# Altium schematic sheet GEM_AVD_eFuse.SchDoc: GEM AVD eFuse
size 594 x 420 mm; Author: G.Kasprowicz; CompanyName: WUT ISE; DrawnBy: G.Kasprowicz; Organization: WUT ISE; Address1: PW ISE; Address2: Nowowiejska 15/19 00-665 Warsaw; Address3: gkasprow@gmail.com; Revision: 2; SheetNumber: 1; SheetTotal: 6; ModifiedBy: -; CheckedDate: -; Title2: Top; DivGrp: WUT ISE; Designer: G.Kasprowicz; ModifiedDate: -; ProjectName: Sensor Box
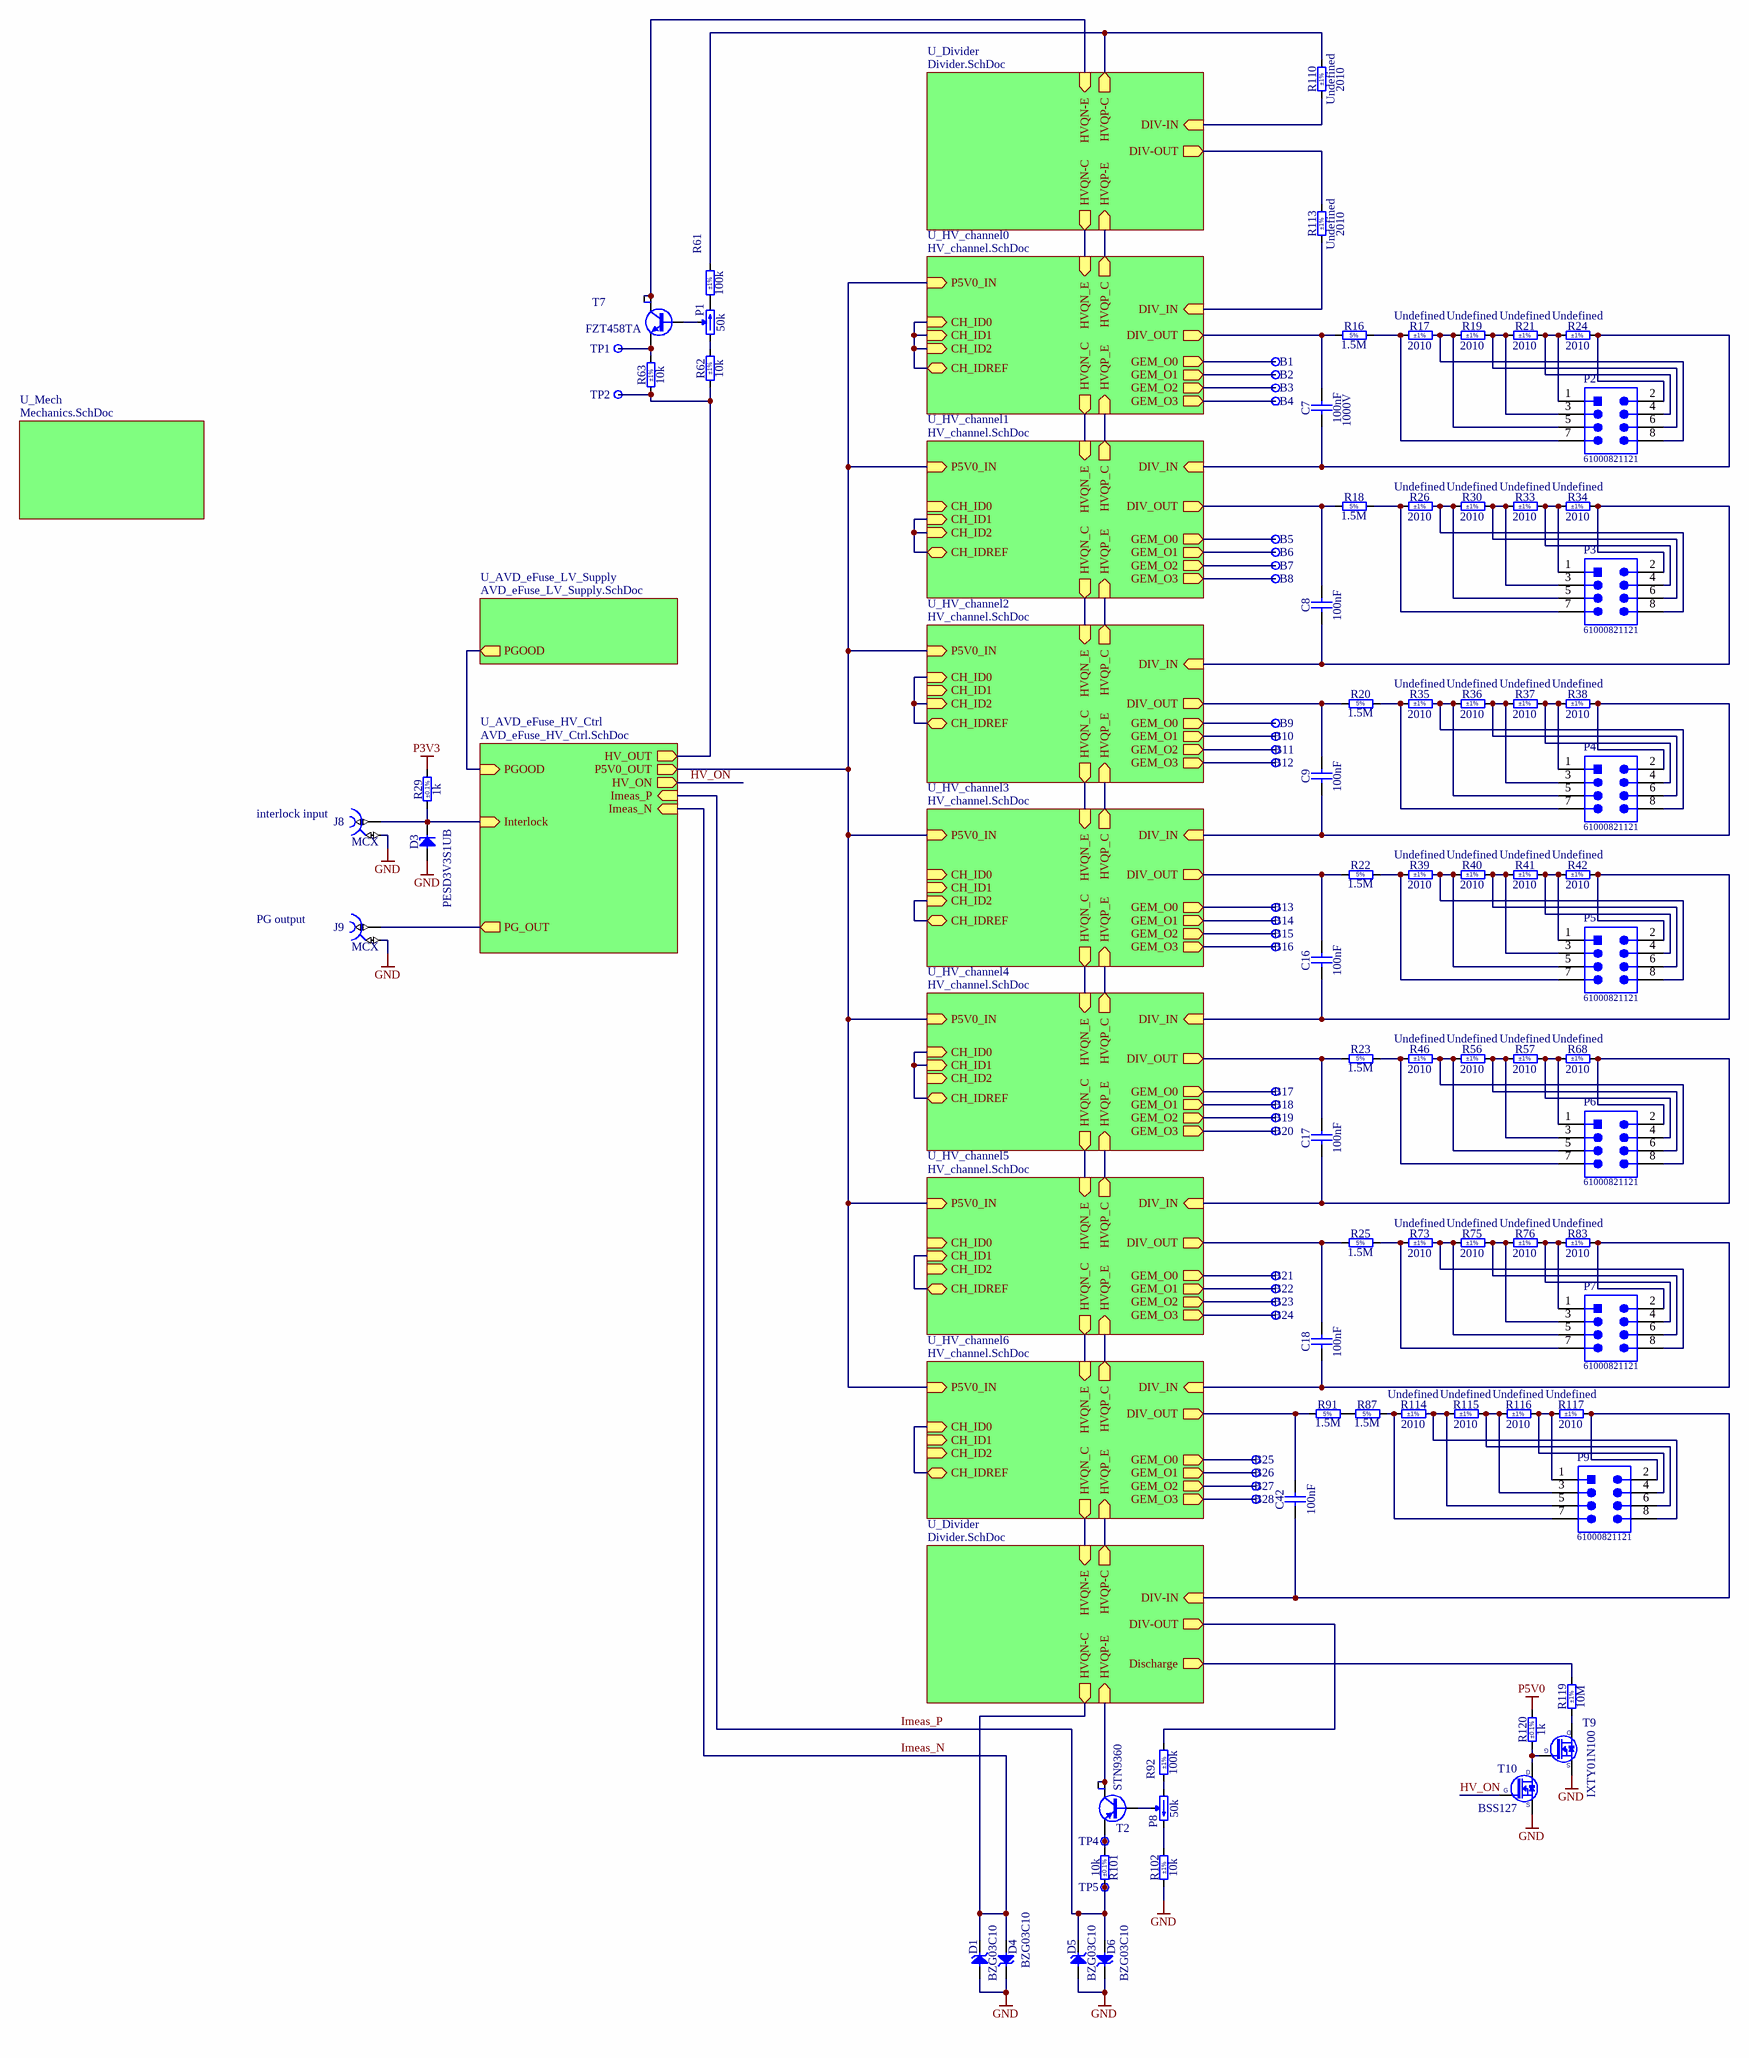
[diagram p0: GEM_AVD_eFuse.SchDoc]

## Parts
B1  Socket  [MULTI-CONTACT_23.1000]  (value not drawn)
B2  Socket  [MULTI-CONTACT_23.1000]  (value not drawn)
B3  Socket  [MULTI-CONTACT_23.1000]  (value not drawn)
B4  Socket  [MULTI-CONTACT_23.1000]  (value not drawn)
B5  Socket  [MULTI-CONTACT_23.1000]  (value not drawn)
B6  Socket  [MULTI-CONTACT_23.1000]  (value not drawn)
B7  Socket  [MULTI-CONTACT_23.1000]  (value not drawn)
B8  Socket  [MULTI-CONTACT_23.1000]  (value not drawn)
B9  Socket  [MULTI-CONTACT_23.1000]  (value not drawn)
B10  Socket  [MULTI-CONTACT_23.1000]  (value not drawn)
B11  Socket  [MULTI-CONTACT_23.1000]  (value not drawn)
B12  Socket  [MULTI-CONTACT_23.1000]  (value not drawn)
B13  Socket  [MULTI-CONTACT_23.1000]  (value not drawn)
B14  Socket  [MULTI-CONTACT_23.1000]  (value not drawn)
B15  Socket  [MULTI-CONTACT_23.1000]  (value not drawn)
B16  Socket  [MULTI-CONTACT_23.1000]  (value not drawn)
B17  Socket  [MULTI-CONTACT_23.1000]  (value not drawn)
B18  Socket  [MULTI-CONTACT_23.1000]  (value not drawn)
B19  Socket  [MULTI-CONTACT_23.1000]  (value not drawn)
B20  Socket  [MULTI-CONTACT_23.1000]  (value not drawn)
B21  Socket  [MULTI-CONTACT_23.1000]  (value not drawn)
B22  Socket  [MULTI-CONTACT_23.1000]  (value not drawn)
B23  Socket  [MULTI-CONTACT_23.1000]  (value not drawn)
B24  Socket  [MULTI-CONTACT_23.1000]  (value not drawn)
B25  Socket  [MULTI-CONTACT_23.1000]  (value not drawn)
B26  Socket  [MULTI-CONTACT_23.1000]  (value not drawn)
B27  Socket  [MULTI-CONTACT_23.1000]  (value not drawn)
B28  Socket  [MULTI-CONTACT_23.1000]  (value not drawn)
C7  100nF  Voltage: 1000V  [CAPC4532X185N]
C8  100nF  [CAPC4532X185N]
C9  100nF  [CAPC4532X185N]
C16  100nF  [CAPC4532X185N]
C17  100nF  [CAPC4532X185N]
C18  100nF  [CAPC4532X185N]
C42  100nF  [CAPC4532X185N]
D1  BZG03C10  [DIOM5326X230N]
D3  PESD3V3S1UB  [SODFL1608X65N]
D4  BZG03C10  [DIOM5326X230N]
D5  BZG03C10  [DIOM5326X230N]
D6  BZG03C10  [DIOM5326X230N]
J8  MCX  [AMPHENOL_919-383J-51A]
J9  MCX  [AMPHENOL_919-383J-51A]
P1  50k  [TRIM_BOURNS_3266W]
P2  61000821121  [61000821121]
P3  61000821121  [61000821121]
P4  61000821121  [61000821121]
P5  61000821121  [61000821121]
P6  61000821121  [61000821121]
P7  61000821121  [61000821121]
P8  50k  [TRIM_BOURNS_3266W]
P9  61000821121  [61000821121]
R16  1.5M  [RESC3225X70N]
R17  Undefined  Tolerance: ±1%  Case: 2010  [RES_VISHAY_CRHV2010A]
R18  1.5M  [RESC3225X70N]
R19  Undefined  Tolerance: ±1%  Case: 2010  [RES_VISHAY_CRHV2010A]
R20  1.5M  [RESC3225X70N]
R21  Undefined  Tolerance: ±1%  Case: 2010  [RES_VISHAY_CRHV2010A]
R22  1.5M  [RESC3225X70N]
R23  1.5M  [RESC3225X70N]
R24  Undefined  Tolerance: ±1%  Case: 2010  [RES_VISHAY_CRHV2010A]
R25  1.5M  [RESC3225X70N]
R26  Undefined  Tolerance: ±1%  Case: 2010  [RES_VISHAY_CRHV2010A]
R29  1k  Tolerance: ±0.1%  [RESC1608X55N]
R30  Undefined  Tolerance: ±1%  Case: 2010  [RES_VISHAY_CRHV2010A]
R33  Undefined  Tolerance: ±1%  Case: 2010  [RES_VISHAY_CRHV2010A]
R34  Undefined  Tolerance: ±1%  Case: 2010  [RES_VISHAY_CRHV2010A]
R35  Undefined  Tolerance: ±1%  Case: 2010  [RES_VISHAY_CRHV2010A]
R36  Undefined  Tolerance: ±1%  Case: 2010  [RES_VISHAY_CRHV2010A]
R37  Undefined  Tolerance: ±1%  Case: 2010  [RES_VISHAY_CRHV2010A]
R38  Undefined  Tolerance: ±1%  Case: 2010  [RES_VISHAY_CRHV2010A]
R39  Undefined  Tolerance: ±1%  Case: 2010  [RES_VISHAY_CRHV2010A]
R40  Undefined  Tolerance: ±1%  Case: 2010  [RES_VISHAY_CRHV2010A]
R41  Undefined  Tolerance: ±1%  Case: 2010  [RES_VISHAY_CRHV2010A]
R42  Undefined  Tolerance: ±1%  Case: 2010  [RES_VISHAY_CRHV2010A]
R46  Undefined  Tolerance: ±1%  Case: 2010  [RES_VISHAY_CRHV2010A]
R56  Undefined  Tolerance: ±1%  Case: 2010  [RES_VISHAY_CRHV2010A]
R57  Undefined  Tolerance: ±1%  Case: 2010  [RES_VISHAY_CRHV2010A]
R61  100k  Tolerance: ±1%  [RESC6331X70N]
R62  10k  Tolerance: ±1%  [RESC3216X65N]
R63  10k  Tolerance: ±1%  [RESC3216X65N]
R68  Undefined  Tolerance: ±1%  Case: 2010  [RES_VISHAY_CRHV2010A]
R73  Undefined  Tolerance: ±1%  Case: 2010  [RES_VISHAY_CRHV2010A]
R75  Undefined  Tolerance: ±1%  Case: 2010  [RES_VISHAY_CRHV2010A]
R76  Undefined  Tolerance: ±1%  Case: 2010  [RES_VISHAY_CRHV2010A]
R83  Undefined  Tolerance: ±1%  Case: 2010  [RES_VISHAY_CRHV2010A]
R87  1.5M  [RESC3225X70N]
R91  1.5M  [RESC3225X70N]
R92  100k  Tolerance: ±1%  [RESC6331X70N]
R101  10k  Tolerance: ±0.1%  [RESC1608X64N]
R102  10k  Tolerance: ±1%  [RESC3216X65N]
R110  Undefined  Tolerance: ±1%  Case: 2010  [RES_VISHAY_CRHV2010A]
R113  Undefined  Tolerance: ±1%  Case: 2010  [RES_VISHAY_CRHV2010A]
R114  Undefined  Tolerance: ±1%  Case: 2010  [RES_VISHAY_CRHV2010A]
R115  Undefined  Tolerance: ±1%  Case: 2010  [RES_VISHAY_CRHV2010A]
R116  Undefined  Tolerance: ±1%  Case: 2010  [RES_VISHAY_CRHV2010A]
R117  Undefined  Tolerance: ±1%  Case: 2010  [RES_VISHAY_CRHV2010A]
R119  10M  Tolerance: ±1%  [RESC5025X65N]
R120  1k  Tolerance: ±0.1%  [RESC1608X55N]
T2  STN9360  [SOT230P700X180-4N]
T7  FZT458TA  [SOT230P700X180-4N]
T9  IXTY01N100  [TO228P991X238-3N-R648X546]
T10  BSS127  [SOT95P240X110-3N]
TP1  Test Point  [TPS127]  (value not drawn)
TP2  Test Point  [TPS127]  (value not drawn)
TP4  Test Point  [TPS127]  (value not drawn)
TP5  Test Point  [TPS127]  (value not drawn)

## Sub-sheets
U_AVD_eFuse_HV_Ctrl = AVD_eFuse_HV_Ctrl.SchDoc: Imeas_P (in), HV_OUT (out), Imeas_N (in), P5V0_OUT (out), PGOOD (in), Interlock (in), PG_OUT (out), HV_ON (out)
U_AVD_eFuse_LV_Supply = AVD_eFuse_LV_Supply.SchDoc: PGOOD (out)
U_Divider = Divider.SchDoc: DIV-IN (in), DIV-OUT (out), HVQN-C (out), HVQN-E (in), HVQP-C (out), HVQP-E (in)
U_Divider = Divider.SchDoc: DIV-IN (in), DIV-OUT (out), HVQN-C (out), HVQN-E (in), HVQP-C (out), HVQP-E (in), Discharge (out)
U_HV_channel0 = HV_channel.SchDoc: DIV_IN (in), DIV_OUT (out), HVQN_C (out), HVQN_E (in), P5V0_IN (in), CH_ID0 (in), CH_ID1 (in), CH_ID2 (in), CH_IDREF (bidir), GEM_O0 (out), GEM_O1 (out), GEM_O2 (out), GEM_O3 (out), HVQP_C (out), HVQP_E (in)
U_HV_channel1 = HV_channel.SchDoc: DIV_IN (in), DIV_OUT (out), HVQN_C (out), HVQN_E (in), P5V0_IN (in), CH_ID0 (in), CH_ID1 (in), CH_ID2 (in), CH_IDREF (bidir), GEM_O0 (out), GEM_O1 (out), GEM_O2 (out), GEM_O3 (out), HVQP_C (out), HVQP_E (in)
U_HV_channel2 = HV_channel.SchDoc: DIV_IN (in), DIV_OUT (out), HVQN_E (in), HVQN_C (out), P5V0_IN (in), CH_ID0 (in), CH_ID1 (in), CH_ID2 (in), CH_IDREF (bidir), GEM_O0 (out), GEM_O1 (out), GEM_O2 (out), GEM_O3 (out), HVQP_C (out), HVQP_E (in)
U_HV_channel3 = HV_channel.SchDoc: DIV_IN (in), DIV_OUT (out), HVQN_C (out), HVQN_E (in), P5V0_IN (in), CH_ID0 (in), CH_ID1 (in), CH_ID2 (in), CH_IDREF (bidir), GEM_O0 (out), GEM_O1 (out), GEM_O2 (out), GEM_O3 (out), HVQP_C (out), HVQP_E (in)
U_HV_channel4 = HV_channel.SchDoc: DIV_IN (in), DIV_OUT (out), HVQN_C (out), HVQN_E (in), P5V0_IN (in), CH_ID0 (in), CH_ID1 (in), CH_ID2 (in), CH_IDREF (bidir), GEM_O0 (out), GEM_O1 (out), GEM_O2 (out), GEM_O3 (out), HVQP_C (out), HVQP_E (in)
U_HV_channel5 = HV_channel.SchDoc: DIV_IN (in), DIV_OUT (out), HVQN_C (out), HVQN_E (in), P5V0_IN (in), CH_ID0 (in), CH_ID1 (in), CH_ID2 (in), CH_IDREF (bidir), GEM_O0 (out), GEM_O1 (out), GEM_O2 (out), GEM_O3 (out), HVQP_C (out), HVQP_E (in)
U_HV_channel6 = HV_channel.SchDoc: DIV_IN (in), DIV_OUT (out), HVQN_C (out), HVQN_E (in), P5V0_IN (in), CH_ID0 (in), CH_ID1 (in), CH_ID2 (in), CH_IDREF (bidir), GEM_O0 (out), GEM_O1 (out), GEM_O2 (out), GEM_O3 (out), HVQP_C (out), HVQP_E (in)
U_Mech = Mechanics.SchDoc: no entries

## Nets
GND: D1.2(A) D3.2(A) D4.1(C) D5.2(A) D6.1(C) J8.2 J9.2 R102.2 T9.2(S) T10.2(S)
P3V3: R29.2
P5V0: R120.2
HV_ON: T10.1(G) ; sheet U_AVD_eFuse_HV_Ctrl/HV_ON
Imeas_N: D1.1(C) D4.2(A) ; sheet U_AVD_eFuse_HV_Ctrl/Imeas_N, sheet U_Divider/HVQN-C
Imeas_P: D5.1(C) D6.2(A) R101.2 TP5.1 ; sheet U_AVD_eFuse_HV_Ctrl/Imeas_P
NetB1_1: B1.1 ; sheet U_HV_channel0/GEM_O0
NetB2_1: B2.1 ; sheet U_HV_channel0/GEM_O1
NetB3_1: B3.1 ; sheet U_HV_channel0/GEM_O2
NetB4_1: B4.1 ; sheet U_HV_channel0/GEM_O3
NetB5_1: B5.1 ; sheet U_HV_channel1/GEM_O0
NetB6_1: B6.1 ; sheet U_HV_channel1/GEM_O1
NetB7_1: B7.1 ; sheet U_HV_channel1/GEM_O2
NetB8_1: B8.1 ; sheet U_HV_channel1/GEM_O3
NetB9_1: B9.1 ; sheet U_HV_channel2/GEM_O0
NetB10_1: B10.1 ; sheet U_HV_channel2/GEM_O1
NetB11_1: B11.1 ; sheet U_HV_channel2/GEM_O2
NetB12_1: B12.1 ; sheet U_HV_channel2/GEM_O3
NetB13_1: B13.1 ; sheet U_HV_channel3/GEM_O0
NetB14_1: B14.1 ; sheet U_HV_channel3/GEM_O1
NetB15_1: B15.1 ; sheet U_HV_channel3/GEM_O2
NetB16_1: B16.1 ; sheet U_HV_channel3/GEM_O3
NetB17_1: B17.1 ; sheet U_HV_channel4/GEM_O0
NetB18_1: B18.1 ; sheet U_HV_channel4/GEM_O1
NetB19_1: B19.1 ; sheet U_HV_channel4/GEM_O2
NetB20_1: B20.1 ; sheet U_HV_channel4/GEM_O3
NetB21_1: B21.1 ; sheet U_HV_channel5/GEM_O0
NetB22_1: B22.1 ; sheet U_HV_channel5/GEM_O1
NetB23_1: B23.1 ; sheet U_HV_channel5/GEM_O2
NetB24_1: B24.1 ; sheet U_HV_channel5/GEM_O3
NetB25_1: B25.1 ; sheet U_HV_channel6/GEM_O0
NetB26_1: B26.1 ; sheet U_HV_channel6/GEM_O1
NetB27_1: B27.1 ; sheet U_HV_channel6/GEM_O2
NetB28_1: B28.1 ; sheet U_HV_channel6/GEM_O3
NetC7_1: C7.1 P2.2 R24.2 ; sheet U_HV_channel1/DIV_IN
NetC7_2: C7.2 R16.1 ; sheet U_HV_channel0/DIV_OUT
NetC8_1: C8.1 P3.2 R34.2 ; sheet U_HV_channel2/DIV_IN
NetC8_2: C8.2 R18.1 ; sheet U_HV_channel1/DIV_OUT
NetC9_1: C9.1 P4.2 R38.2 ; sheet U_HV_channel3/DIV_IN
NetC9_2: C9.2 R20.1 ; sheet U_HV_channel2/DIV_OUT
NetC16_1: C16.1 P5.2 R42.2 ; sheet U_HV_channel4/DIV_IN
NetC16_2: C16.2 R22.1 ; sheet U_HV_channel3/DIV_OUT
NetC17_1: C17.1 P6.2 R68.2 ; sheet U_HV_channel5/DIV_IN
NetC17_2: C17.2 R23.1 ; sheet U_HV_channel4/DIV_OUT
NetC18_1: C18.1 P7.2 R83.2 ; sheet U_HV_channel6/DIV_IN
NetC18_2: C18.2 R25.1 ; sheet U_HV_channel5/DIV_OUT
NetC42_1: C42.1 P9.2 R117.2 ; sheet U_Divider/DIV-IN
NetC42_2: C42.2 R91.1 ; sheet U_HV_channel6/DIV_OUT
NetD3_1: D3.1(C) J8.1 R29.1 ; sheet U_AVD_eFuse_HV_Ctrl/Interlock
NetJ9_1: J9.1 ; sheet U_AVD_eFuse_HV_Ctrl/PG_OUT
NetP1_1: P1.1(CCW) R62.2
NetP1_2: P1.2(W) T7.1(B)
NetP1_3: P1.3(CW) R61.1
NetP2_1: P2.1 P2.4 R21.2 R24.1
NetP2_3: P2.3 P2.6 R19.2 R21.1
NetP2_5: P2.5 P2.8 R17.2 R19.1
NetP2_7: P2.7 R16.2 R17.1
NetP3_1: P3.1 P3.4 R33.2 R34.1
NetP3_3: P3.3 P3.6 R30.2 R33.1
NetP3_5: P3.5 P3.8 R26.2 R30.1
NetP3_7: P3.7 R18.2 R26.1
NetP4_1: P4.1 P4.4 R37.2 R38.1
NetP4_3: P4.3 P4.6 R36.2 R37.1
NetP4_5: P4.5 P4.8 R35.2 R36.1
NetP4_7: P4.7 R20.2 R35.1
NetP5_1: P5.1 P5.4 R41.2 R42.1
NetP5_3: P5.3 P5.6 R40.2 R41.1
NetP5_5: P5.5 P5.8 R39.2 R40.1
NetP5_7: P5.7 R22.2 R39.1
NetP6_1: P6.1 P6.4 R57.2 R68.1
NetP6_3: P6.3 P6.6 R56.2 R57.1
NetP6_5: P6.5 P6.8 R46.2 R56.1
NetP6_7: P6.7 R23.2 R46.1
NetP7_1: P7.1 P7.4 R76.2 R83.1
NetP7_3: P7.3 P7.6 R75.2 R76.1
NetP7_5: P7.5 P7.8 R73.2 R75.1
NetP7_7: P7.7 R25.2 R73.1
NetP8_1: P8.1(CCW) R92.2
NetP8_2: P8.2(W) T2.1(B)
NetP8_3: P8.3(CW) R102.1
NetP9_1: P9.1 P9.4 R116.2 R117.1
NetP9_3: P9.3 P9.6 R115.2 R116.1
NetP9_5: P9.5 P9.8 R114.2 R115.1
NetP9_7: P9.7 R87.2 R114.1
NetR61_2: R61.2 R110.2 ; sheet U_Divider/HVQP-C
NetR62_1: R62.1 R63.1 TP2.1 ; sheet U_AVD_eFuse_HV_Ctrl/HV_OUT
NetR63_2: R63.2 T7.3(E) TP1.1
NetR87_1: R87.1 R91.2
NetR92_1: R92.1 ; sheet U_Divider/DIV-OUT
NetR101_1: R101.1 T2.3(E) TP4.1
NetR110_1: R110.1 ; sheet U_Divider/DIV-IN
NetR113_1: R113.1 ; sheet U_HV_channel0/DIV_IN
NetR113_2: R113.2 ; sheet U_Divider/DIV-OUT
NetR119_1: R119.1 T9.3(D)
NetR119_2: R119.2 ; sheet U_Divider/Discharge
NetR120_1: R120.1 T9.1(G) T10.3(D)
NetT2_2: T2.2(C) T2.4(C) ; sheet U_Divider/HVQP-E
NetT7_2: T7.2(C) T7.4(C) ; sheet U_Divider/HVQN-E
(unnamed): sheet U_HV_channel0/HVQN_C, sheet U_HV_channel1/HVQN_E
(unnamed): sheet U_HV_channel0/HVQN_E, sheet U_Divider/HVQN-C
(unnamed): sheet U_HV_channel0/P5V0_IN, sheet U_HV_channel1/P5V0_IN, sheet U_HV_channel2/P5V0_IN, sheet U_HV_channel3/P5V0_IN, sheet U_HV_channel4/P5V0_IN, sheet U_HV_channel5/P5V0_IN, sheet U_HV_channel6/P5V0_IN, sheet U_AVD_eFuse_HV_Ctrl/P5V0_OUT
(unnamed): sheet U_HV_channel0/CH_ID0, sheet U_HV_channel0/CH_ID1, sheet U_HV_channel0/CH_ID2, sheet U_HV_channel0/CH_IDREF
(unnamed): sheet U_HV_channel0/HVQP_C, sheet U_Divider/HVQP-E
(unnamed): sheet U_HV_channel0/HVQP_E, sheet U_HV_channel1/HVQP_C
(unnamed): sheet U_HV_channel1/HVQN_C, sheet U_HV_channel2/HVQN_E
(unnamed): sheet U_HV_channel1/CH_ID1, sheet U_HV_channel1/CH_ID2, sheet U_HV_channel1/CH_IDREF
(unnamed): sheet U_HV_channel1/HVQP_E, sheet U_HV_channel2/HVQP_C
(unnamed): sheet U_HV_channel2/HVQN_C, sheet U_HV_channel3/HVQN_E
(unnamed): sheet U_HV_channel2/CH_ID0, sheet U_HV_channel2/CH_ID2, sheet U_HV_channel2/CH_IDREF
(unnamed): sheet U_HV_channel2/HVQP_E, sheet U_HV_channel3/HVQP_C
(unnamed): sheet U_HV_channel3/HVQN_C, sheet U_HV_channel4/HVQN_E
(unnamed): sheet U_HV_channel3/CH_ID2, sheet U_HV_channel3/CH_IDREF
(unnamed): sheet U_HV_channel3/HVQP_E, sheet U_HV_channel4/HVQP_C
(unnamed): sheet U_HV_channel4/HVQN_C, sheet U_HV_channel5/HVQN_E
(unnamed): sheet U_HV_channel4/CH_ID0, sheet U_HV_channel4/CH_ID1, sheet U_HV_channel4/CH_IDREF
(unnamed): sheet U_HV_channel4/HVQP_E, sheet U_HV_channel5/HVQP_C
(unnamed): sheet U_HV_channel5/HVQN_C, sheet U_HV_channel6/HVQN_E
(unnamed): sheet U_HV_channel5/CH_ID1, sheet U_HV_channel5/CH_IDREF
(unnamed): sheet U_HV_channel5/HVQP_E, sheet U_HV_channel6/HVQP_C
(unnamed): sheet U_HV_channel6/HVQN_C, sheet U_Divider/HVQN-E
(unnamed): sheet U_HV_channel6/CH_ID0, sheet U_HV_channel6/CH_IDREF
(unnamed): sheet U_HV_channel6/HVQP_E, sheet U_Divider/HVQP-C
(unnamed): sheet U_AVD_eFuse_LV_Supply/PGOOD, sheet U_AVD_eFuse_HV_Ctrl/PGOOD

## Notes on the sheet
- (near J8) interlock input
- (near J9) PG output
- Project/Equipment
- Document
- File
- Designer
- Drawn by
- Check.by
- Last Mod.
- Copyright WUT ISE 2024.
  This documentation describes Open Hardware and is licensed under the CERN OHL-W v.2.0. You may redistribute and modify this documentation under the terms of the CERN OHL-W v.2.0. (http://ohwr.org/CERNOHL). This documentation is distributed WITHOUT ANY EXPRESS OR IMPLIED WARRANTY, INCLUDING OF MERCHANTABILITY, SATISFACTORY QUALITY AND FITNESS FOR A PARTICULAR PURPOSE. Please see the CERN OHL v.2.0 for applicable conditions.
- Contact
- Print Date
- Sheet
- Size
- A2
- of
- Rev
- (in symbol R1210_1.5M_5%_0.5W_100PPM) 5%

## Library data of the parts
B1-B28 = MULTI-CONTACT_23.1000: Single Terminal Socket; Part Description: Machined Brass Uninsulated Ø 2 mm Rigid Socket, LB2-A Type; PressFit: No; Part Number: MULTI-CONTACT_23.1000; Component Kind: Standard; Component Type: Standard; Pin Count: 1; Family: Socket; Mounted: Yes; Socket: No; SMD: No; Sense: No; Status: None; Manufacturer: MULTI-CONTACT; Manufacturer Part Number: 23.1000; ComponentHeight: 2mm; HelpURL: \\cern.ch\dfs\Applications\Altium\Datasheets\MULTI-CONTACT_23.1000.pdf; Author: CERN DEM JLC; CreateDate: 20.03.2012; LatestRevisionDate: 20.03.2012
C7 = CC1812_100NF_1000V_10%_X7R_KEMET_HV FT-CAP: Non-polarised capacitor; Part Description: High Voltage Flexible Termination System (HV FT-CAP) SMD Multilayer Ceramic  Chip Capacitor; Manufacturer: KEMET; Manufacturer Part Number: C1812X104KDRACTU; TC: X7R; Tolerance: ±10%; Part Number: CC1812_100NF_1000V_10%_X7R_KEMET_HV FT-CAP; Component Kind: Standard; Component Type: Standard; Pin Count: 2; Value: 100nF; Status: None; Case: 1812; Mounted: Yes; Socket: No; SMD: Yes; Sense: No; ComponentHeight: 1.85mm; HelpURL: \\cern.ch\dfs\Applications\Altium\Datasheets\CC1812_X7R_KEMET_HV FT-CAP.pdf; Author: CERN DEM MR; CreateDate: 20.04.2017; LatestRevisionDate: 20.04.2017
C8 C9 C16-C18 C42 = CC1812_100NF_1000V_10%_X7R_KEMET_HV FT-CAP: Non-polarised capacitor; Part Description: High Voltage Flexible Termination System (HV FT-CAP) SMD Multilayer Ceramic  Chip Capacitor; Manufacturer: KEMET; Manufacturer Part Number: C1812X104KDRACTU; Voltage: 1000V; TC: X7R; Tolerance: ±10%; Part Number: CC1812_100NF_1000V_10%_X7R_KEMET_HV FT-CAP; Component Kind: Standard; Component Type: Standard; Pin Count: 2; Value: 100nF; Status: None; Case: 1812; Mounted: Yes; Socket: No; SMD: Yes; Sense: No; ComponentHeight: 1.85mm; HelpURL: \\cern.ch\dfs\Applications\Altium\Datasheets\CC1812_X7R_KEMET_HV FT-CAP.pdf; Author: CERN DEM MR; CreateDate: 20.04.2017; LatestRevisionDate: 20.04.2017
D1 D4-D6 = BZG03C10: Zener Diode; Part Description: Voltage Regulator Diode; Manufacturer: VISHAY SEMICONDUCTORS; Voltage: 10V; Power: 1.25W; PressFit: No; Bonding: No; Part Number: BZG03C10; Component Kind: Standard; Component Type: Standard; Device: BZG03C10; PackageDescription: DO-214-AC/SMA Molded Diode, Body 5.3x2.6mm, IPC Medium Density; Manufacturer Part Number: BZG03C10; Pin Count: 2; Case: DO-214AC; Mounted: Yes; Socket: No; SMD: Yes; Sense: No; ComponentHeight: 2.3mm; HelpURL: \\cern.ch\dfs\Applications\Altium\Datasheets\BZG03C.pdf; Author: CERN DEM JLC; CreateDate: 02.06.2008; LatestRevisionDate: 02.06.2008
D3 = PESD3V3S1UB: ESD protection diode; Part Description: ESD protection diode (23kV); Manufacturer: NXP SEMICONDUCTORS; Voltage: 3V3; Power: 330W; PressFit: No; Bonding: No; Part Number: PESD3V3S1UB; Component Kind: Standard; Component Type: Standard; Device: PESD3V3S1UB; PackageDescription: Ultra Small Outline Diode Flat Lead (SOD-523), Body; 1.2mm L X 0.8mm W X 0.65mm H, IPC Medium Density; Manufacturer Part Number: PESD3V3S1UB; Pin Count: 2; Case: SOD523; Mounted: Yes; Socket: No; SMD: Yes; Sense: No; ComponentHeight: 0.65mm; HelpURL: \\cern.ch\dfs\Applications\Altium\Datasheets\PESD3V3S1UB.pdf; Author: CERN DEM JLC; CreateDate: 29.11.2012; LatestRevisionDate: 29.11.2012
J8 J9 = AMPHENOL_919-383J-51A: Part Description: 50 Ohms, RF Connector, MCX Right Angle PCB Receptacle Jack; PressFit: No; Part Number: AMPHENOL_919-383J-51A; Component Kind: Standard; Component Type: Standard; Pin Count: 5; Family: MCX; Mounted: Yes; Socket: No; SMD: No; Sense: No; Status: None; Manufacturer: AMPHENOL; Manufacturer Part Number: 919-383J-51A; ComponentHeight: 6mm; HelpURL: \\cern.ch\dfs\Applications\Altium\Datasheets\AMPHENOL_919-383J-51A.pdf; Author: CERN DEM BC; CreateDate: 31.01.2019; LatestRevisionDate: 31.01.2019
P1 P8 = TRIM_12T_50K_BOURNS_3266W-1-503LF: Trimming Potentiometer; Part Description: 12 Turn Trimming Potentiometer (Top Adjustment); Manufacturer: BOURNS; Power: 0.25W; TC: ±100ppm/°C; Tolerance: ±10%; PressFit: No; Part Number: TRIM_12T_50K_BOURNS_3266W-1-503LF; Component Kind: Standard; Component Type: Standard; Pin Count: 3; Value: 50k; Manufacturer Part Number: 3266W-1-503LF; Case: 3266W; Mounted: Yes; Socket: No; SMD: No; Sense: No; ComponentHeight: 7.75mm; HelpURL: \\cern.ch\dfs\Applications\Altium\Datasheets\TRIM_BOURNS_3266W.pdf; Author: CERN DEM JMW; CreateDate: 29.07.2009; LatestRevisionDate: 28.11.2012
P2-P7 P9 = 61000821121: WR-PHD Pin Header, SMT, pitch 2.54mm, Dual Row, Vertical, 8p; Manufacturer: Wurth Elektronik; Pin Number: 8; Rated Current: 3A; Working Voltage: 250VAC; Withstanding Voltage: 500VAC; Contact Resistance: 20mOhm; ComponentLink1Description: Manufacturer; ComponentLink1URL: http://www.we-online.de; ComponentLink2Description: Datasheet; ComponentLink2URL: https://www.we-online.com/catalog/datasheet/61000821121.pdf; Manufacturer Part Number: 61000821121; Pitch: 2.54mm; Operating Temperature: -40 to +125degC; Mounting Technology: SMT; Packaging: Tube; Gender: Pin Header; Row Number: Dual; Orientation: Vertical
R16 R18 R20 R22 R23 R25 R87 R91 = R1210_1.5M_5%_0.5W_100PPM: Resistor - 5%; Part Description: Thin Film Chip Resistor; Manufacturer: GENERIC; Manufacturer1 Part Number: CRGCQ1210J1M5; Power: 0.5W; TC: ±100ppm/°C; PressFit: No; Part Number: R1210_1.5M_5%_0.5W_100PPM; Component Kind: Standard; Component Type: Standard; Pin Count: 2; Value: 1.5M; Status: None; Tolerance: ±5%; Manufacturer Part Number: R1210_1.5M_5%_0.5W_100PPM; Case: 1210; Mounted: Yes; Sense: No; Socket: No; SMD: Yes; Manufacturer1 Example: TYCO ELECTRONICS; Manufacturer1 ComponentHeight: 0.65mm; HelpURL: \\cern.ch\dfs\Applications\Altium\Datasheets\R1210_TYCO_CRGCQ.pdf; Author: CERN DEM HF; CreateDate: 05.02.2023; LatestRevisionDate: 05.02.2023
R17 R19 R21 R24 R26 R30 R33-R42 R46 R56 R57 R68 R73 R75 R76 R83 R110 R113-R117 = R2010_1G_1%_0.5W_100PPM_VISHAY_CRHV2010AF1G00FKET: Resistor - 1%; Manufacturer: VISHAY TECHNO; Power: 0.5W; TC: ±100ppm/°C; PressFit: No; Part Number: Undefined; Component Kind: Standard; Component Type: Standard; Pin Count: 2; Value: Undefined; Status: None; Part Description: Undefined; Manufacturer Part Number: Undefined; Mounted: Yes; Sense: No; Socket: No; SMD: Yes; ComponentHeight: 0.68mm; HelpURL: \\cern.ch\dfs\Applications\Altium\Datasheets\R2010_VISHAY_CRHV.pdf; Author: CERN DEM JLC; CreateDate: 03.06.2015; LatestRevisionDate: 03.06.2015
R29 R120 = R0603_1K_0.1%_0.063W_10PPM: Resistor - 0.1%; Part Description: Thin Film Chip Resistor; Manufacturer: GENERIC; Manufacturer1 Part Number: RN73C1J1K0BTG; Power: 0.063W; TC: ±10ppm; PressFit: No; Part Number: R0603_1K_0.1%_0.063W_10PPM; Component Kind: Standard; Component Type: Standard; Pin Count: 2; Value: 1k; Status: Not Recommended; Manufacturer Part Number: R0603_1K_0.1%_0.063W_10PPM; Case: 0603; Mounted: Yes; Sense: No; Socket: No; SMD: Yes; Manufacturer1 Example: TYCO HOLSWORTHY; Manufacturer1 ComponentHeight: 0.55mm; HelpURL: \\cern.ch\dfs\Applications\Altium\Datasheets\R0603_Tyco_RN73.pdf; Author: CERN DEM BC; CreateDate: 23.05.2016; LatestRevisionDate: 23.05.2016
R61 R92 = R2512_100K_1%_1W_100PPM: Resistor - 1%; Part Description: Thick Film Chip Resistor; Manufacturer: GENERIC; Manufacturer1 Part Number: 232276361004L or RC2512FK-07100KL; Power: 1W; TC: ±100ppm/°C; PressFit: No; Part Number: R2512_100K_1%_1W_100PPM; Component Kind: Standard; Component Type: Standard; Pin Count: 2; Value: 100k; Status: Preferred; Manufacturer Part Number: R2512_100K_1%_1W_100PPM; Case: 2512; Mounted: Yes; Sense: No; Socket: No; SMD: Yes; Manufacturer1 Example: YAGEO PHYCOMP; Manufacturer1 ComponentHeight: 0.65mm; HelpURL: \\cern.ch\dfs\Applications\Altium\Datasheets\R2512_Phycomp_RC2512.pdf; Author: CERN DEM JLC; CreateDate: 21.07.2008; LatestRevisionDate: 17.10.2012
R62 R63 R102 = R1206_10K_1%_0.25W_100PPM: Resistor - 1%; Part Description: General Purpose Thick Film Chip Resistor; Manufacturer: GENERIC; Manufacturer1 Part Number: NRC12F1002TRF; Power: 0.25W; TC: ±100ppm/°C; PressFit: No; Part Number: R1206_10K_1%_0.25W_100PPM; Component Kind: Standard; Component Type: Standard; Pin Count: 2; Value: 10k; Status: Preferred; Manufacturer Part Number: R1206_10K_1%_0.25W_100PPM; Case: 1206; Mounted: Yes; Sense: No; Socket: No; SMD: Yes; Manufacturer1 Example: NIC COMPONENT; Manufacturer1 ComponentHeight: 0.65mm; HelpURL: \\cern.ch\dfs\Applications\Altium\Datasheets\R1206_NIC_NRC.pdf; Author: CERN DEM JLC; CreateDate: 03.12.2007; LatestRevisionDate: 13.03.2008
R101 = R0603_10K_0.1%_0.1W_25PPM: Resistor - 0.1%; Part Description: Thin Film Chip Resistor; Manufacturer: GENERIC; Manufacturer1 Part Number: ERA3AEB103V; Power: 0.1W; TC: ±25ppm/°C; PressFit: No; Part Number: R0603_10K_0.1%_0.1W_25PPM; Component Kind: Standard; Component Type: Standard; Pin Count: 2; Value: 10k; Status: Not Recommended; Manufacturer Part Number: R0603_10K_0.1%_0.1W_25PPM; Case: 0603; Mounted: Yes; Sense: No; Socket: No; SMD: Yes; Manufacturer1 Example: PANASONIC; Manufacturer1 ComponentHeight: 0.55mm; HelpURL: \\cern.ch\dfs\Applications\Altium\Datasheets\R0603_PANASONIC_ERA.pdf; Author: CERN DEM JMW; CreateDate: 09.11.2015; LatestRevisionDate: 11.01.2017
R119 = R2010_10M_1%_0.5W_200PPM: Resistor - 1%; Part Description: Thick Film Chip Resistor; Manufacturer: GENERIC; Manufacturer1 Part Number: LHVC2010-10MFT4; Power: 0.5W; TC: ±200ppm/°C; PressFit: No; Part Number: R2010_10M_1%_0.5W_200PPM; Component Kind: Standard; Component Type: Standard; Pin Count: 2; Value: 10M; Status: None; Manufacturer Part Number: R2010_10M_1%_0.5W_200PPM; Case: 2010; Mounted: Yes; Sense: No; Socket: No; SMD: Yes; Manufacturer1 Example: TT WELWYN; Manufacturer1 ComponentHeight: 0.65mm; HelpURL: \\cern.ch\dfs\Applications\Altium\Datasheets\R2010_WELWYN_LHVC.pdf; Author: CERN DEM JLC; CreateDate: 26.02.2015; LatestRevisionDate: 26.02.2015
T2 = STN9360: PNP Transistor; Part Description: 250V 100mA PNP High-Voltage Transistors; Manufacturer: STMicroelectronics; PressFit: No; Bonding: No; Part Number: STN9360; Component Kind: Standard; Component Type: Standard; Device: STN9360; PackageDescription: SOT223, 2.30mm Pitch; 4 Pin, 3.70mm W X 6.70mm L X 1.80mm H body, IPC Medium Density; Manufacturer Part Number: STN9360; Pin Count: 4; Case: SOT223; Mounted: Yes; Socket: No; SMD: Yes; Sense: No; ComponentHeight: 1.8mm; HelpURL: \\cern.ch\dfs\Applications\Altium\Datasheets\BF723,115.pdf; Author: FS; CreateDate: 15.06.2011; LatestRevisionDate: 15.06.2011
T7 = FZT458TA: NPN Transistor; Part Description: 400V 300mA NPN High Voltage Transistor; Manufacturer: DIODES INCORPORATED; PressFit: No; Bonding: No; Part Number: FZT458TA; Component Kind: Standard; Component Type: Standard; Device: FZT458TA; PackageDescription: SOT223, 2.30mm Pitch; 4 Pin, 3.70mm W X 6.70mm L X 1.80mm H body, IPC Medium Density; Manufacturer Part Number: FZT458TA; Pin Count: 4; Case: SOT223; Mounted: Yes; Socket: No; SMD: Yes; Sense: No; ComponentHeight: 1.8mm; HelpURL: \\cern.ch\dfs\Applications\Altium\Datasheets\FZT458TA.pdf; Author: CERN DEM JLC; CreateDate: 15.06.2011; LatestRevisionDate: 15.06.2011
T9 = IXTY01N100: N-CHANNEL MOSFET WITH DIODE; Part Description: 1000V 100mA N-Channel High Voltage MOSFET; Manufacturer: IXYS; PressFit: No; Bonding: No; Part Number: IXTY01N100; Component Kind: Standard; Component Type: Standard; Device: IXTY01N100; PackageDescription: TO-252AA DPAK TO, 2.28mm pitch; 2 pin,9.91mm L X 6.095mm W X 2.38mm H body, IPC Medium Density; Manufacturer Part Number: IXTY01N100; Pin Count: 3; Case: DPAK; Mounted: Yes; Socket: No; SMD: Yes; Sense: No; ComponentHeight: 2.38mm; HelpURL: \\cern.ch\dfs\Applications\Altium\Datasheets\IXTY01N100.pdf; Author: CERN DEM JLC; CreateDate: 04.02.2009; LatestRevisionDate: 31.01.2011
T10 = BSS127: N-CHANNEL MOSFET WITH DIODE; Part Description: 600V 21mA N-Channel SIPMOS® Small-Signal-Transistor; Manufacturer: INFINEON; PressFit: No; Bonding: No; Part Number: BSS127; Component Kind: Standard; Component Type: Standard; Device: BSS127; PackageDescription: SOT23, 0.95mm Pitch; 3 Pin, 1.40mm W X 3.00mm L X 1.10mm H body, IPC Medium Density; Manufacturer Part Number: BSS127; Pin Count: 3; Case: SOT23-3; Mounted: Yes; Socket: No; SMD: Yes; Sense: No; ComponentHeight: 1.1mm; HelpURL: \\cern.ch\dfs\Applications\Altium\Datasheets\BSS127.pdf; Author: CERN DEM HF; CreateDate: 30.05.2023; LatestRevisionDate: 30.05.2023
TP1 TP2 TP4 TP5 = SMD_PAD_1.27X1.27MM: Part Description: 1.27mm x 1.27mm PCB Copper Area (SMD Test Point); Mounted: No; Part Number: SMD_PAD_1.27X1.27MM; Component Kind: Standard (No BOM); Component Type: Standard (No BOM); Pin Count: 1; Family: Test Point; Socket: No; SMD: No; Sense: No; Status: None; ComponentHeight: 0mm; HelpURL: Undefined; Author: CERN DEM JLC; CreateDate: 12.01.2008; LatestRevisionDate: 12.01.2008; PackageDescription: 1.27mm x 1.27mm PCB Copper Area (SMD Test Point)